# EAGLE design BUZZI-20 (EAGLE 4.15)
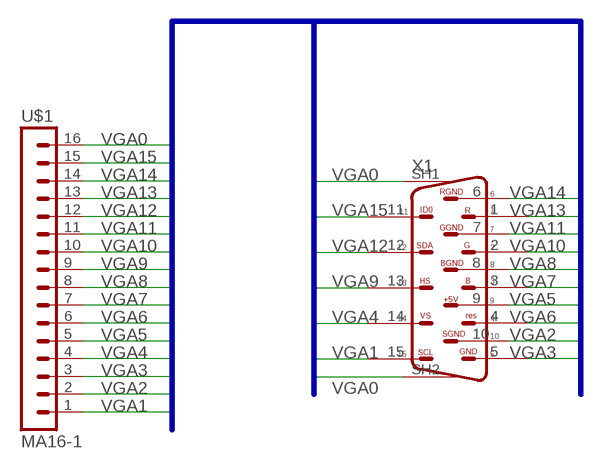
[diagram p0: schematic, sheet 1]

## Parts
U$1  MA16-1  [MA16-1]
X1  VGAM  [HD15M]

## Nets
VGA0: U$1.16 X1.SH1 X1.SH2
VGA1: U$1.1 X1.15
VGA2: U$1.2 X1.10
VGA3: U$1.3 X1.5
VGA4: U$1.4 X1.14
VGA5: U$1.5 X1.9
VGA6: U$1.6 X1.4
VGA7: U$1.7 X1.3
VGA8: U$1.8 X1.8
VGA9: U$1.9 X1.13
VGA10: U$1.10 X1.2
VGA11: U$1.11 X1.7
VGA12: U$1.12 X1.12
VGA13: U$1.13 X1.1
VGA14: U$1.14 X1.6
VGA15: U$1.15 X1.11

## Buses
VGA[0..15]

## Library data of the parts
U$1 = turbod3:MA16-1
X1 = HD15_B:VGAM

## Net classes
0 default: width 0.3 mm

## Board
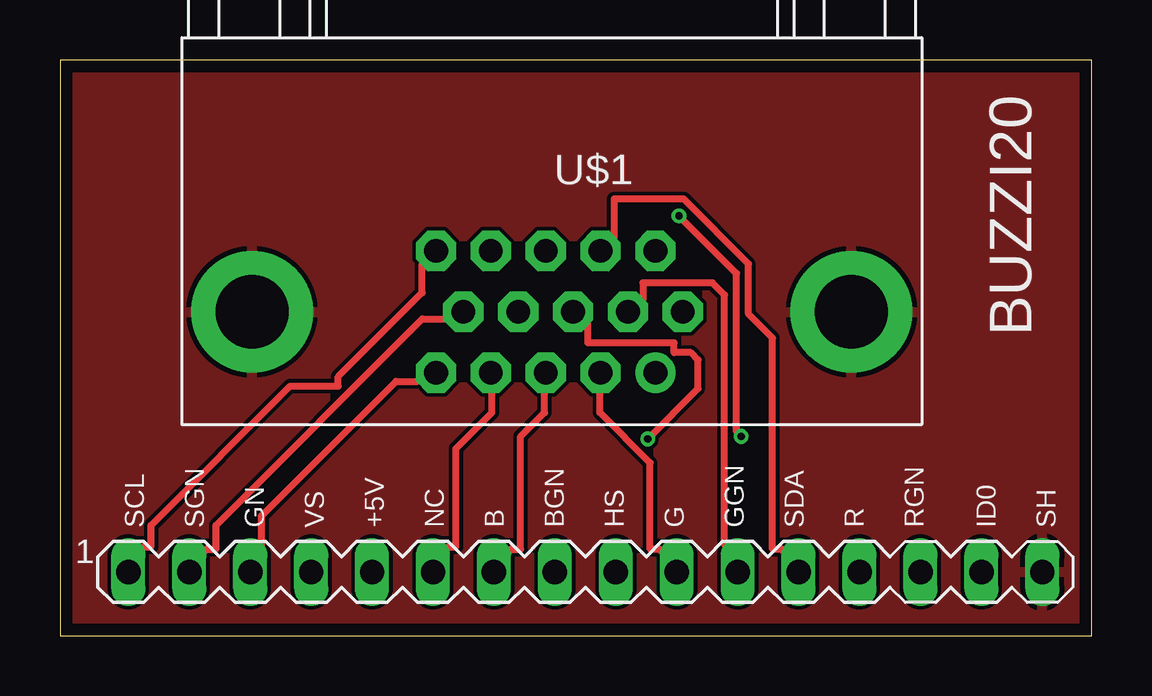
[diagram p1: board, top side]
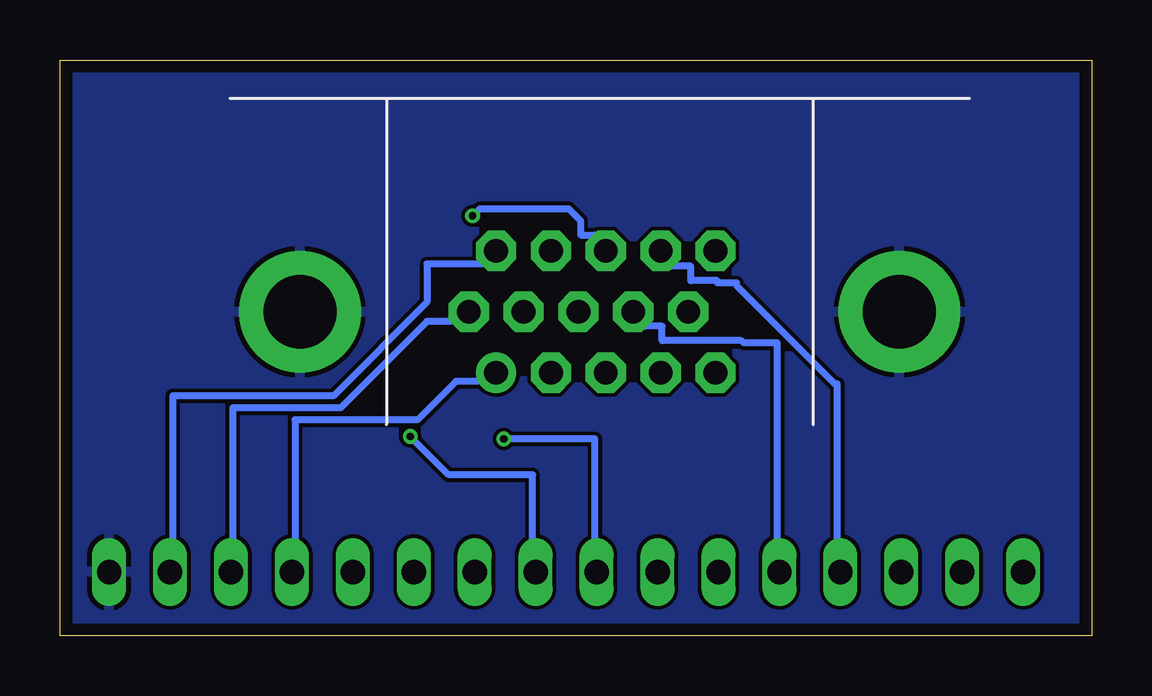
[diagram p2: board, bottom side, seen from below]

Size 43 x 24 mm. Coordinates in mm from the lower left corner, seen from the top.
Outline: 0,0 43,0 43,24 0,24 0,0
Copper layers (1*16): Top 0.035mm / dielectric 1.5mm / Bottom 0.035mm
Design rules "PCB-POOL": minimum track width 6mil, minimum drill 12mil, track to track 6mil, track to pad 6mil, pad to pad 6mil, via to via 6mil, smd to smd 6mil, copper to edge 20mil, drill to drill 8mil, minimum pad ring 8mil, minimum via ring 6mil, stop-mask expansion 3mil, vias tented up to drill 0mil, thermal gap 8mil

### Footprints (pad centres in the part's own frame; a part is rotated, then mirrored left to right if it is on the bottom)
MA16-1 = drill 1.016 long: 1 -17.78,0; 2 -15.24,0; 3 -12.7,0; 4 -10.16,0; 5 -7.62,0; 6 -5.08,0; 7 -2.54,0; 8 0,0; 9 2.54,0; 10 5.08,0; 11 7.62,0; 12 10.16,0; 13 12.7,0; 14 15.24,0; 15 17.78,0; 16 20.32,0
HD15M = drill 0.991 pad 1.676 round: 1 4.318,-2.54 | drill 0.991 pad 1.676 octagon: 2 2.032,-2.54; 3 -0.254,-2.54; 4 -2.54,-2.54; 5 -4.826,-2.54; 6 5.461,0; 7 3.175,0; 8 0.889,0; 9 -1.397,0; 10 -3.683,0; 11 4.318,2.54; 12 2.032,2.54; 13 -0.254,2.54; 14 -2.54,2.54; 15 -4.826,2.54 | drill 3.048 pad 5.08 round: SH1 12.497,0; SH2 -12.497,0

### Placement (x,y rotation side)
U$1  20.63,2.65 0 top
X1  20.5,13.5 0 top

### Tracks (layer width: path | path; a pad name or v marks a point on that pad's centre or on a via)
VGA0
  pour Bottom: 0.5,23.5 42.5,23.5 42.5,0.5 0.5,0.5
  pour Top: 0.5,23.5 42.5,23.5 42.5,0.5 0.5,0.5
VGA1
  Top 0.3: U$1.1 3.5,3.7 3.8,3.7 3.8,4.6 9.6,10.4 11.6,10.4 11.6,10.8 15.1,14.3 15.1,15.5 X1.15
VGA2
  Top 0.3: U$1.2 6.1,3.6 6.5,3.6 6.5,4.6 15.1,13.2 16,13.2 X1.10
VGA3
  Top 0.3: U$1.3 8.4,3.8 8.4,5 14,10.6 14.9,10.6 X1.5
VGA4
  Bottom 0.3: U$1.4 10.6,4 10.6,10.5 10.7,10.5 14.8,14.6 14.8,14.7 15.6,14.7 15.6,14.8 16.7,14.8 16.7,15.4 17.5,15.4 X1.14
VGA5
  Bottom 0.3: U$1.5 13.1,4 13.1,12.2 14.5,12.2 14.6,12.3 17.9,12.3 17.9,12.9 18.6,12.9 X1.9
VGA6
  Top 0.3: U$1.6 16.2,3.7 16.5,3.7 16.5,7.8 18,9.3 18,10.2 X1.4
VGA7
  Top 0.3: U$1.7 18.8,3.6 19.2,3.6 19.2,8.3 20.2,9.3 20.2,10.2 X1.3
VGA8  (via drill 0.3)
  Top 0.3: v24.5,8.2 26.6,10.3 26.6,11.5 26.3,11.8 25.6,11.8 25.6,12.2 22,12.2 22,13 X1.8
  Bottom 0.3: v24.5,8.2 20.7,8.2 20.7,4 U$1.8
VGA9  (via drill 0.3)
  Top 0.3: v28.4,8.3 28.2,8.5 28.2,15.1 v25.8,17.5
  Bottom 0.3: v28.4,8.3 26.8,6.7 23.3,6.7 23.3,4 U$1.9 | v25.8,17.5 25.5,17.8 21.8,17.8 21.3,17.3 21.3,16.7 20.7,16.7 X1.13
VGA10
  Top 0.3: U$1.10 25,3.6 24.6,3.6 24.6,7.2 22.5,9.3 22.5,10.2 X1.2
VGA11
  Top 0.3: U$1.11 27.7,3.8 27.7,14.2 27.2,14.7 24.3,14.7 24.3,14 X1.7
VGA12
  Top 0.3: U$1.12 30.1,3.6 29.7,3.6 29.7,12.4 28.7,13.4 28.7,15.5 26,18.2 23.1,18.2 23.1,16.6 X1.12
VGA13
  Bottom 0.3: U$1.13 33.2,4 33.2,9 28.1,9 26.5,10.6 25.6,10.6 X1.1
VGA14
  Bottom 0.3: U$1.14 35.8,4 35.8,9.5 31.3,9.5 27.7,13.1 26.7,13.1 X1.6
VGA15
  Bottom 0.3: U$1.15 38.3,4 38.3,10 31.6,10 27.7,13.9 27.7,15.5 25.4,15.5 X1.11

### Text on the board
tPlace: BUZZI20 | SCL | SGN | GN | VS | +5V | NC | B | BGN | HS | G | GGN | SDA | R | RGN | ID0 | SH